# EAGLE design N64_RGBAmp (EAGLE 7.7.0)
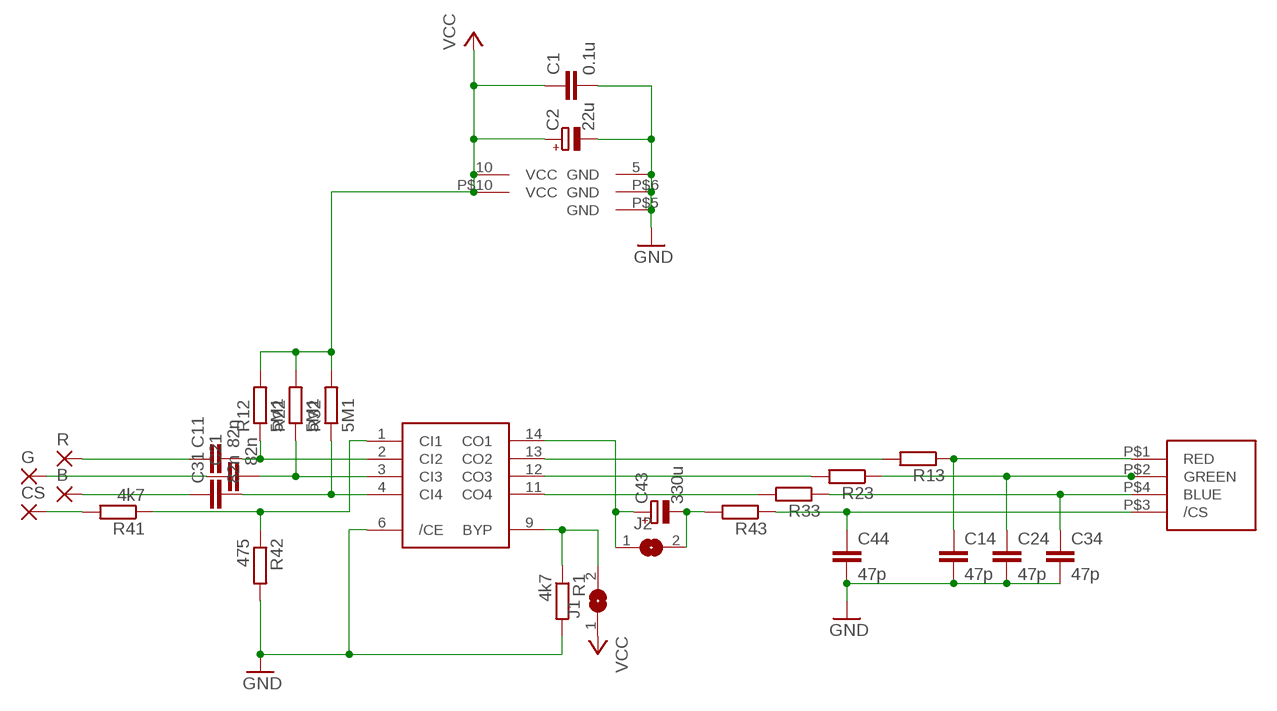
[diagram p0: schematic, sheet 1]

## Parts
B  SMD2  [SMD1,27-2,54]
C1  0.1u  C-EUC0603K  [C0603K]
C2  22u  CPOL-EUSMCB  [SMC_B]
C11  82n  C-EUC0603K  [C0603K]
C14  47p  C-EUC0603K  [C0603K]
C21  82n  C-EUC0603K  [C0603K]
C24  47p  C-EUC0603K  [C0603K]
C31  82n  C-EUC0603K  [C0603K]
C34  47p  C-EUC0603K  [C0603K]
C43  330u  CPOL-EUSMCD  [SMC_D]
C44  47p  C-EUC0603K  [C0603K]
CS  SMD2  [SMD1,27-2,54]
G  SMD2  [SMD1,27-2,54]
J1  SJ  [SJ]
J2  SJ  [SJ]
J3  SNES_MULTIAV_RGBC_ONLY  [SNES_MULTIAV_RGBC_ONLY]
R  SMD2  [SMD1,27-2,54]
R1  4k7  R-EU_R0603  [R0603]
R12  5M1  R-EU_R0603  [R0603]
R13  R-EU_R0603  [R0603]
R22  5M1  R-EU_R0603  [R0603]
R23  R-EU_R0603  [R0603]
R32  5M1  R-EU_R0603  [R0603]
R33  R-EU_R0603  [R0603]
R41  4k7  R-EU_R0603  [R0603]
R42  475  R-EU_R0603  [R0603]
R43  R-EU_R0603  [R0603]
U1  THS7374  [THS7374]

## Nets
GND: C1.2 C2.- C14.2 C24.2 C34.2 C44.2 J3.P$5(GND) J3.P$6(GND) R1.2 R42.2 U1.5(GND) U1.6(/CE)
N$1: C21.2 R22.1 U1.3(CI3)
N$2: R41.1 R42.1 U1.1(CI1)
N$3: J1.2 R1.1 U1.9(BYP)
N$4: C11.2 R12.1 U1.2(CI2)
N$5: C14.1 J3.P$1(RED) R13.1
N$6: C24.1 J3.P$2(GREEN) R23.1
N$7: R13.2 U1.13(CO2)
N$8: R23.2 U1.12(CO3)
N$9: C34.1 J3.P$4(BLUE) R33.1
N$10: C43.+ J2.1 U1.14(CO1)
N$11: R33.2 U1.11(CO4)
N$14: C11.1 R.1(P)
N$15: C21.1 G.1(P)
N$16: B.1(P) C31.1
N$17: CS.1(P) R41.2
N$19: C43.- J2.2 R43.2
N$20: C44.1 J3.P$3(/CS) R43.1
R9: C31.2 R32.1 U1.4(CI4)
VCC: C1.1 C2.+ J1.1 J3.P$10(VCC) R12.2 R22.2 R32.2 U1.10(VCC)

## Library data of the parts
B CS G R = wirepad:SMD2: SMD PAD
C1 C11 C14 C21 C24 C31 C34 C44 = rcl:C-EU: CAPACITOR, European symbol
C2 C43 = rcl:CPOL-EU: POLARIZED CAPACITOR, European symbol
J1 J2 = jumper:SJ: SMD solder JUMPER
J3 = snes_div:SNES_MULTIAV_RGBC_ONLY
R1 R12 R13 R22 R23 R32 R33 R41-R43 = rcl:R-EU_: RESISTOR, European symbol
U1 = snes_div:THS7374

## Board
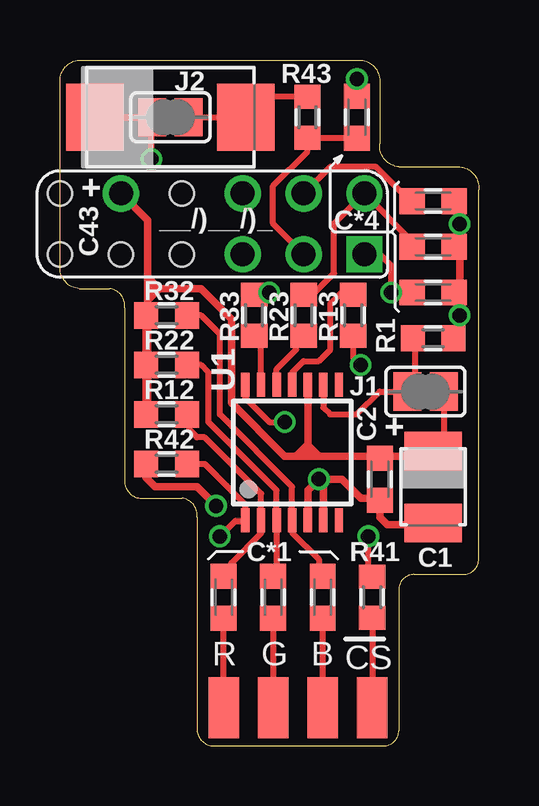
[diagram p1: board, top side]
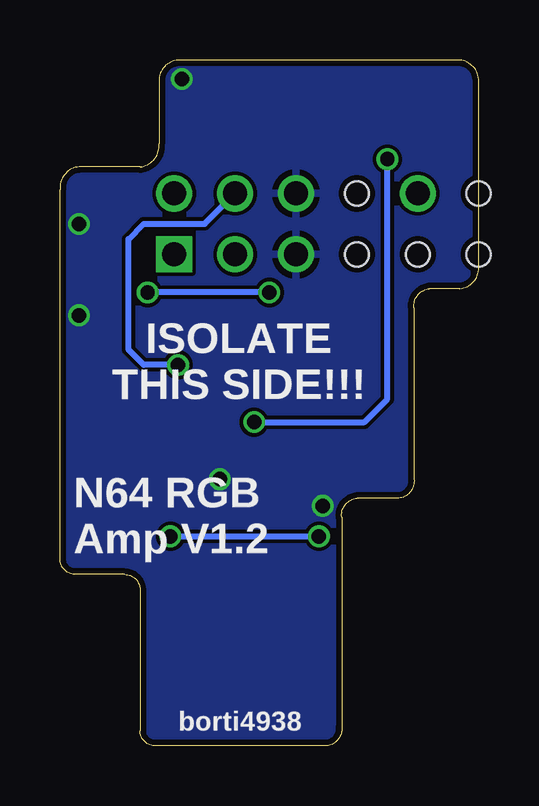
[diagram p2: board, bottom side, seen from below]

Size 17.47 x 28.58 mm. Coordinates in mm from the lower left corner, seen from the top.
Outline: 2.7,18.26 arc90 2.07,19.05 0.8,19.05 arc-90 0,20 0,27.78 arc-90 0.96,28.57 12.54,28.57 arc-90 13.34,27.62 13.34,25.08 arc90 14.13,24.13 16.67,24.13 arc-90 17.47,23.18 17.47,7.78 arc-90 16.83,7.14 14.77,7.14 arc90 14.13,6.51 14.13,0.63 arc-90 13.5,0 6.35,0 arc-90 5.72,0.79 5.72,9.52 arc90 5.08,10.32 3.34,10.32 arc-90 2.7,11.11 2.7,18.26
Copper layers (1*16): Top 0.035mm / dielectric 1.5mm / Bottom 0.035mm
Design rules "ITEADstudio_DRC": minimum track width 6mil, minimum drill 12mil, track to track 6mil, track to pad 6mil, pad to pad 6mil, via to via 6mil, smd to smd 0mil, copper to edge 10mil, drill to drill 10mil, minimum pad ring 10mil, minimum via ring 6mil, stop-mask expansion 2mil, vias tented up to drill 30mil, thermal gap 10mil

### Footprints (pad centres in the part's own frame; a part is rotated, then mirrored left to right if it is on the bottom)
SMD1,27-2,54 = smd 1.27 x 2.54: 1 0,0
C0603K = smd 1.05 x 1.08: 1 -0.875,0; 2 0.875,0
SMC_B = smd 1.6 x 2.4: + -1.5,0; - 1.5,0
SMC_D = smd 2.4 x 2.8: + -3.15,0; - 3.15,0
SJ = smd 1.168 x 1.6: 1 -0.762,0; 2 0.762,0
SNES_MULTIAV_RGBC_ONLY = drill 1 square: P$1 6.35,-1.27 | drill 1: P$2 6.35,1.27; P$3 3.81,-1.27; P$4 3.81,1.27; P$5 1.27,-1.27; P$6 1.27,1.27; P$10 -3.81,1.27 | hole 1: -1.27,-1.27; -1.27,1.27; -3.81,-1.27; -6.35,-1.27; -6.35,1.27
R0603 = smd 1 x 1.1: 1 -0.85,0; 2 0.85,0
THS7374 = smd 0.35 x 1: 1 -1.95,-2.825; 2 -1.3,-2.825; 3 -0.65,-2.825; 4 0,-2.825; 5 0.65,-2.825; 6 1.3,-2.825; 7 1.95,-2.825; 8 1.95,2.825; 9 1.3,2.825; 10 0.65,2.825; 11 0,2.825; 12 -0.65,2.825; 13 -1.3,2.825; 14 -1.95,2.825

### Placement (x,y rotation side)
B  10.96,1.59 0 top
C1  13.34,11.11 270 top
C2  15.56,10.79 270 top
C11  6.83,6.19 90 top
C14  15.56,18.89 0 top
C21  8.89,6.19 90 top
C24  15.56,20.8 0 top
C31  10.96,6.19 90 top
C34  15.56,22.7 0 top
C43  4.61,26.19 0 top
C44  12.39,26.19 90 top
CS  13.02,1.59 0 top
G  8.89,1.59 0 top
J1  15.24,14.76 180 top
J2  4.61,26.19 0 top
J3  6.35,21.75 0 top
R  6.83,1.59 0 top
R1  15.56,16.99 0 top
R12  4.45,13.81 180 top
R13  8.1,17.94 270 top
R22  4.45,15.88 180 top
R23  10.16,17.94 270 top
R32  4.45,17.94 180 top
R33  12.23,17.94 90 top
R41  13.02,6.19 270 top
R42  4.45,11.75 180 top
R43  10.32,26.19 90 top
U1  9.69,12.22 0 top

### Tracks (layer width: path | path; a pad name or v marks a point on that pad's centre or on a via)
GND  (via drill 0.6)
  Top 0.305: C44.2 v12.39,27.78 | 16.67,21.11 v16.67,21.75 16.67,22.7 C34.2 | 16.67,21.11 16.67,18.73 | 16.67,18.73 v16.67,17.94 16.67,17.25 R1.2 | C14.2 16.51,18.89 16.67,18.73 | R42.2 3.6,11.17 3.97,10.79 5.72,10.79 v6.51,10 | C24.2 16.44,20.88 16.67,21.11 | 13.26,10.16 C1.2 | C1.2 13.34,9.52 13.66,9.21 15.47,9.21 C2.- | U1.5 10.34,10.65 v10.8,11.11 | v10.8,11.11 11.75,11.11 12.54,10.32 13.26,10.32 C1.2 | U1.6 10.99,10.92 v10.8,11.11
  pour Bottom: -1.9,0.16 19.69,0.16 19.69,29.37 -1.9,29.37
N$1
  Top 0.254: R22.1 5.88,15.87 6.19,15.56 6.19,13.49 9.04,10.65 U1.3 9.04,7.21 C21.2
N$2  (via drill 0.6)
  Top 0.254: R41.1 12.86,7.36 v12.86,8.73 | R42.1 6.04,11.75 7.74,10.05 U1.1 7.7,9.37 7.31,9.37 v6.67,8.73
  Bottom 0.254: v12.86,8.73 v6.67,8.73
  pour Top: 7.31,9.37 7.62,9.68 7.62,9.05
N$3
  Top 0.254: U1.9 10.99,14.1 11.27,13.81 12.39,13.81 13.34,14.76 J1.2 14.8,15.08 14.8,16.9 R1.1
N$4
  Top 0.254: R12.1 5.4,13.71 5.4,13.18 5.72,12.86 6.04,12.86 8.39,10.51 U1.2 8.39,8.86 7.15,7.62 7.15,7.38 C11.2 6.75,6.98
N$5  (via drill 0.6)
  Top 0.254: R13.1 8.1,18.89 v8.73,18.89 | J3.P$1 13.34,20.48 13.81,20 v13.81,18.89 C14.1
  Bottom 0.254: v8.73,18.89 v13.81,18.89
N$6
  Top 0.254: R23.1 10.16,18.89 10.64,18.89 11.43,19.68 11.43,21.75 J3.P$2 14.69,21.04 C24.1 14.29,20.95
N$7
  Top 0.254: U1.13 8.39,16.8 R13.2
N$8
  Top 0.254: U1.12 9.04,15.7 9.85,16.51 9.85,16.77 R23.2
N$9  (via drill 0.6)
  Top 0.254: C34.1 14.45,22.86 13.18,24.13 11.27,24.13 J3.P$4 | R33.1 12.23,16.19 v12.54,15.87
  Bottom 0.254: v12.54,15.87 13.97,15.87 14.61,16.51 14.61,21.11 13.97,21.75 11.43,21.75 J3.P$4
N$10  (via drill 0.6)
  Top 0.254: C43.+ J2.1 3.81,26.16 v3.81,24.45 | U1.14 7.74,14.49 8.73,13.49 v9.37,13.49
  Bottom 0.254: v3.81,24.45 3.81,14.45 4.77,13.49 v9.37,13.49
N$11
  Top 0.254: U1.11 9.69,15.56 10.16,16.03 10.8,16.03 11.27,16.51 11.27,18.41 11.75,18.89 12.12,18.89 R33.2
N$14
  Top 0.254: R.1 C11.1
N$15
  Top 0.254: C21.1 G.1
N$16
  Top 0.254: C31.1 B.1
N$17
  Top 0.254: R41.2 CS.1
N$19
  Top 0.254: R43.2 8.61,27.04 C43.- J2.2
N$20
  Top 0.254: C44.1 12.2,25.34 R43.1 10.32,24.76 8.89,23.34 8.89,21.75 J3.P$3
R9
  Top 0.254: R32.1 5.88,17.94 6.67,17.14 6.67,13.81 9.69,10.79 U1.4 9.69,8.89 10.8,7.78 10.8,7.22 C31.2 10.88,6.98 10.64,6.98
VCC
  Top 0.254: C1.1 13.34,12.06 | J1.1 16.01,12.74 C2.+
  Top 0.305: R12.2 3.6,18.2 | 9.85,12.06 9.37,12.06 7.15,14.29 7.15,17.78 5.88,19.05 4.13,19.05 | 9.85,12.06 10.32,12.54 10.34,12.53 | 10.34,12.53 10.8,12.06 | 10.8,12.06 10.64,12.06 | 9.85,12.06 10.64,12.06 | 10.64,12.06 10.32,12.22 | 4.13,19.05 3.65,19.53 | 3.65,19.53 3.65,19.05 | 3.65,19.05 3.65,18.57 | 3.65,18.57 4.13,19.05 | 4.13,19.05 3.65,19.05 | 3.65,18.57 3.65,17.99 R12.2 | 3.65,19.53 3.65,21.91 J3.P$10 | R12.2 3.6,17.84 3.65,17.78 3.65,15.4 | 3.65,15.4 3.65,13.87 R32.2 | R22.2 3.6,15.45 3.65,15.4 | 10.8,12.06 13.26,12.06 | 13.26,12.06 13.34,12.06 15.63,12.06 C2.+ | U1.10 10.34,12.53 | 13.34,11.91 C1.1 13.26,12.06

### Text on the board
tPlace: J2 | __/)__/)_ | U1 | J1
bPlace: borti4938
tNames: R43 | + | C*4 | C43 | R32 | R33 | R23 | R13 | R22 | R1 | R12 | + | C2 | R42 | C*1 | R41 | C1
bNames: ISOLATE / THIS SIDE!!! | N64 RGB / Amp V1.2